# Altium schematic sheet transmitter.SchDoc
size A3
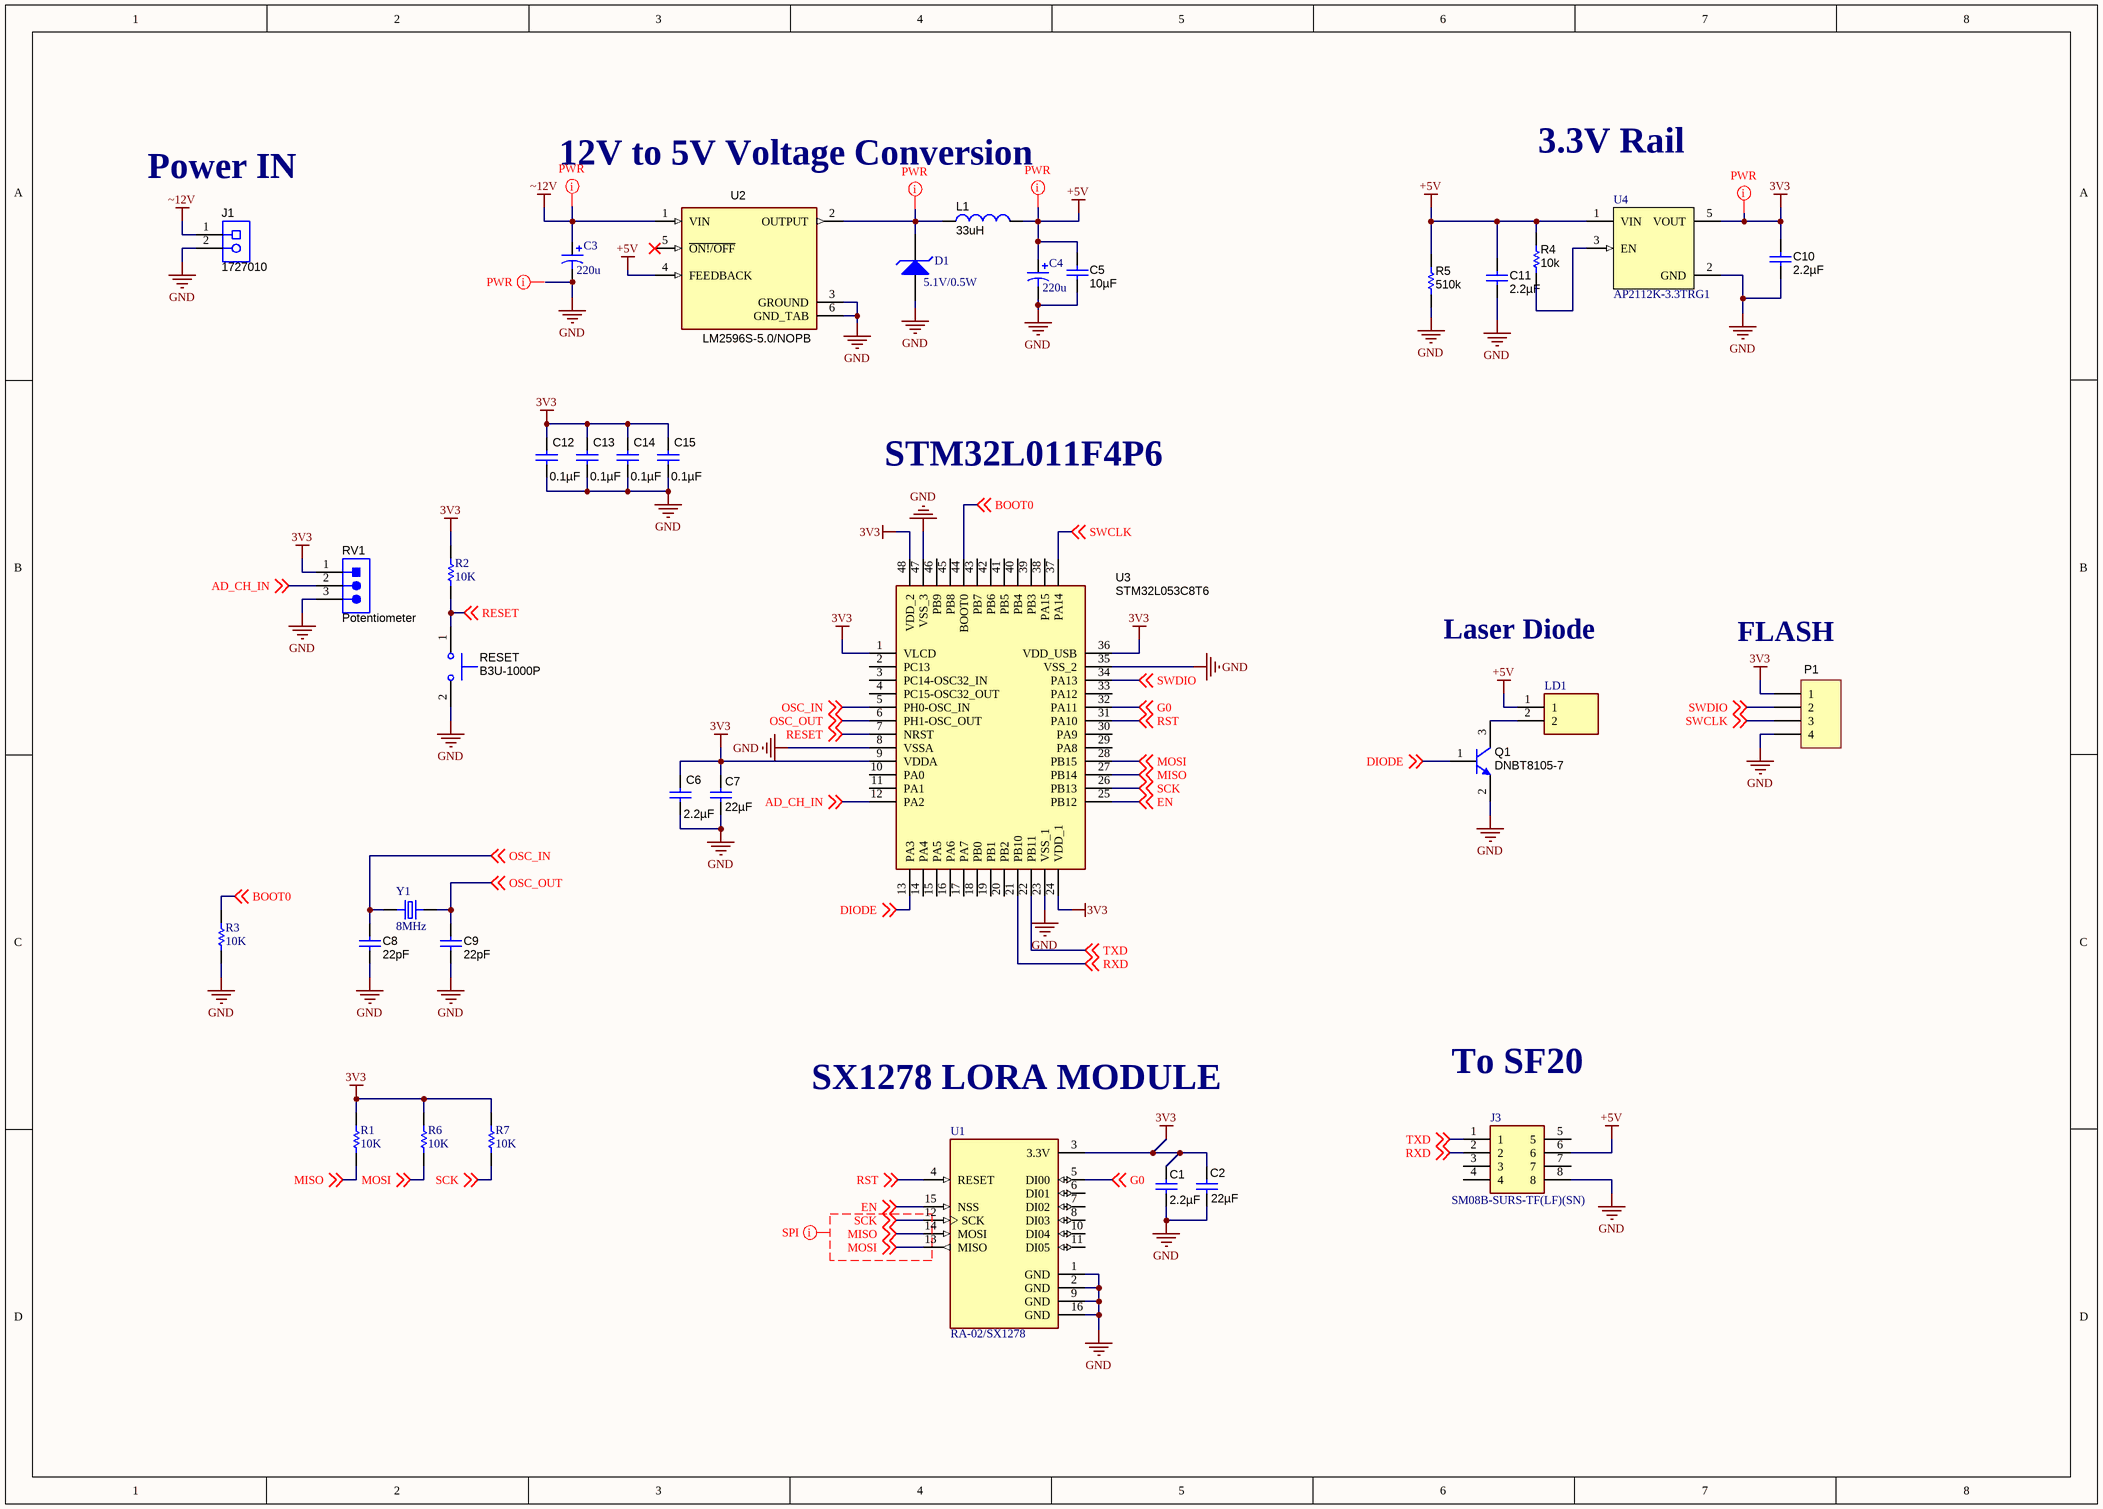
[diagram p0: transmitter.SchDoc]

## Parts
C1  ValueDisplayed: 2.2µF  [0603]  (hidden comment: C1608X6S1C225K080AC)
C2  ValueDisplayed: 22µF  [1206_180]  (hidden comment: C3216X5R1V226M160AC)
C3  220u  [CAPPRD250W50D630H1120B]
C4  220u  [CAPPRD250W50D630H1120B]
C5  ValueDisplayed: 10µF  [0805_HV]  (hidden comment: EMK212BB7106MG-T)
C6  ValueDisplayed: 2.2µF  [0603]  (hidden comment: C1608X6S1C225K080AC)
C7  ValueDisplayed: 22µF  [1206_180]  (hidden comment: C3216X5R1V226M160AC)
C8  ValueDisplayed: 22pF  [0805_HV]  (hidden comment: 0805YD225KAT2A)
C9  ValueDisplayed: 22pF  [0805_HV]  (hidden comment: 0805YD225KAT2A)
C10  ValueDisplayed: 2.2µF  [0805_HV]  (hidden comment: 0805YD225KAT2A)
C11  ValueDisplayed: 2.2µF  [0805_HV]  (hidden comment: 0805YD225KAT2A)
C12  ValueDisplayed: 0.1µF  [0603]  (hidden comment: C1608X6S1C225K080AC)
C13  ValueDisplayed: 0.1µF  [0603]  (hidden comment: C1608X6S1C225K080AC)
C14  ValueDisplayed: 0.1µF  [0603]  (hidden comment: C1608X6S1C225K080AC)
C15  ValueDisplayed: 0.1µF  [0603]  (hidden comment: C1608X6S1C225K080AC)
D1  5.1V/0.5W  [SOD-123]
J1  1727010  [PhoenixConact_1727010]
J3  SM08B-SURS-TF(LF)(SN)  [SM08B-SURS-TF]
L1  33uH  [IND_MSS1210-153MEB]
LD1  Header-2pin(2.5mm)  [B2B-XH-A(LF)(SN)]  (value not drawn)
P1  0901471104  [HDR1X4]  (value not drawn)
Q1  DNBT8105-7  [SOT-23]
R1  10K  [R0805]
R2  10K  [R0805]
R3  10K  [R0805]
R4  ValueDisplayed: 10k  [0603]  (hidden comment: CRCW060310K0JNEA)
R5  ValueDisplayed: 510k  [0805_HV]  (hidden comment: CRCW0805510KJNEA)
R6  10K  [R0805]
R7  10K  [R0805]
RESET  B3U-1000P  [SW_B3U-1000P]
RV1  Potentiometer  [WURTH_61300311121]
U1  RA-02/SX1278  [MODULE_RA-02_LORA]
U2  LM2596S-5.0/NOPB  [TO170P1524X483-6N]
U3  STM32L053C8T6  [QFP50P900X900X160-48N]
U4  AP2112K-3.3TRG1  [SOT95P285X140-5N]
Y1  8MHz  [XTAL_ECS-160-20-4XDN]

## Nets
3V3: C1.1 C2.1 C6.1 C7.1 C10.1 C12.1 C13.1 C14.1 C15.1 P1.1 R1.2 R2.2 R6.2 R7.2 RV1.1 U1.3(3.3V) U3.1(VLCD) U3.9(VDDA) U3.24(VDD_1) U3.36(VDD_USB) U3.48(VDD_2) U4.5(VOUT)
+5V: C4.1 C5.1 C11.1 J3.6 L1.2 LD1.1 R4.2 R5.2 U2.4(FEEDBACK) U4.1(VIN)
GND: C1.2 C2.2 C3.2 C4.2 C5.2 C6.2 C7.2 C8.2 C9.2 C10.2 C11.2 C12.2 C13.2 C14.2 C15.2 D1.1(A) J1.2 J3.8 P1.4 Q1.2(E) R3.1 R5.1 RESET.2 RV1.3 U1.1(GND) U1.2(GND) U1.9(GND) U1.16(GND) U2.3(GROUND) U2.6(GND_TAB) U3.8(VSSA) U3.23(VSS_1) U3.35(VSS_2) U3.47(VSS_3) U4.2(GND)
~12V: C3.1 J1.1 U2.1(VIN)
AD_CH_IN: RV1.2 U3.12(PA2) ; off-sheet AD_CH_IN
BOOT0: R3.2 U3.44(BOOT0) ; off-sheet BOOT0
DIODE: Q1.1(B) U3.13(PA3) ; off-sheet DIODE
EN: U1.15(NSS) U3.25(PB12) ; off-sheet EN
G0: U1.5(DI00) U3.32(PA11) ; off-sheet G0
MISO: R1.1 U1.14(MOSI) U3.27(PB14) ; off-sheet MISO
MOSI: R6.1 U1.13(MISO) U3.28(PB15) ; off-sheet MOSI
OSC_IN: C8.1 U3.5(PH0-OSC_IN) Y1.1 ; off-sheet OSC_IN
OSC_OUT: C9.1 U3.6(PH1-OSC_OUT) Y1.2 ; off-sheet OSC_OUT
RESET: R2.1 RESET.1 U3.7(NRST) ; off-sheet RESET
RST: U1.4(RESET) U3.31(PA10) ; off-sheet RST
RXD: J3.2 U3.21(PB10) ; off-sheet RXD
SCK: R7.1 U1.12(SCK) U3.26(PB13) ; off-sheet SCK
SWCLK: P1.3 U3.37(PA14) ; off-sheet SWCLK
SWDIO: P1.2 U3.34(PA13) ; off-sheet SWDIO
TXD: J3.1 U3.22(PB11) ; off-sheet TXD
NetD1_2: D1.2(K) L1.1 U2.2(OUTPUT)
NetLD1_2: LD1.2 Q1.3(C)
NetR4_1: R4.1 U4.3(EN)

Not connected (* = marked no-connect by the designer): J3 3 4 5 7; U1 6(DI01) 7(DI02) 8(DI03) 10(DI04) 11(DI05); U2 5(~{ON!/OFF})*; U3 2(PC13) 3(PC14-OSC32_IN) 4(PC15-OSC32_OUT) 10(PA0) 11(PA1) 14(PA4) 15(PA5) 16(PA6) 17(PA7) 18(PB0) 19(PB1) 20(PB2) 29(PA8) 30(PA9) 33(PA12) 38(PA15) 39(PB3) 40(PB4) 41(PB5) 42(PB6) 43(PB7) 45(PB8) 46(PB9)

## Layout directives
net class PWR: 3V3, (no net found under the mark), +5V, NetD1_2, ~12V
net class SPI: MISO, MOSI, SCK

## Notes on the sheet
- (near J1) Power IN
- 12V to 5V Voltage Conversion
- 3.3V Rail
- STM32L011F4P6
- Laser Diode
- (near P1) FLASH
- SX1278 LORA MODULE
- To SF20

## Library data of the parts
C1 C6 C12-C15 = C1608X6S1C225K080AC: CAP, CERM, 2.2 µF, 16 V, +/- 10%, X6S, 0603; Manufacturer: TDK; Polarized: N; CompType: Capacitor; Value: 2.2uF; U/M: EA; Cap_F: 0.0000022; Tolerance_%: 10; ESR_ohm: 0.007674; Value1: 0.007674 ohm; VDC_V: 16; Value2: 16V; IRMS_A: 1.87823; TaMin_C: -55; TaMax_C: 105; SizeArea_mm2: 1.28; SizeAreaWB_mm2: 4.68; SizeX_mm: 1.6; SizeY_mm: 0.8; SizeZ_mm: 1; AEC Category: Q200; SymbolVersion: 2008-07-09; PartNumber: C1608X6S1C225K080AC; PackageReference: 0603; RoHS: Y; MountType: SMT; Technology: Ceramic; TempCo: X6S; Cap_Case: 0603; Published: 2008-06-19; Publisher: Texas Instruments; LatestRevisionDate: 2017-04-28; ComponentLink1Description: Datasheet link; ComponentLink1URL: https://product.tdk.com/en/search/capacitor/ceramic/mlcc/info?part_no=C1608X6S1C225K080AC; Supplier 1: Digi-Key; Supplier Part Number 1: 445-7438-1-ND; Supplier 2: Mouser; Supplier Part Number 2: 810-C1608X6S1C225K080AC; AEC Qualified: N; AEC Grade: N/A
C2 C7 = C3216X5R1V226M160AC: CAP, CERM, 22 µF, 35 V,+/- 20%, X5R, 1206; Manufacturer: TDK; Polarized: N; CompType: Capacitor; Value: 22uF; U/M: EA; Cap_F: 0.000022; Tolerance_%: 20; ESR_ohm: 0.002398; Value1: 0.002398 ohm; VDC_V: 35; Value2: 35V; IRMS_A: 4.68507; TaMin_C: -55; TaMax_C: 85; Cap_Case: 1206; SizeArea_mm2: 5.12; SizeAreaWB_mm2: 10.92; SizeX_mm: 3.2; SizeY_mm: 1.6; SizeZ_mm: 1.8; AEC Category: Q200; Green_Lifecycle: Active; Green_REACh: Passed; SymbolVersion: 2008-07-09; PartNumber: C3216X5R1V226M160AC; PackageReference: 1206; RoHS: Y; MountType: SMT; Technology: Ceramic; TempCo: X5R; Published: 2008-06-19; Publisher: Texas Instruments; LatestRevisionDate: 2017-06-22; ComponentLink1Description: Datasheet link; ComponentLink1URL: https://product.tdk.com/en/search/capacitor/ceramic/mlcc/info?part_no=C3216X5R1V226M160AC; Supplier 1: Digi-Key; Supplier Part Number 1: 445-8045-1-ND; Supplier 2: Newark; Supplier Part Number 2: 04X3299; Supplier 3: Mouser; Supplier Part Number 3: 810-C3216X5R1V226M; AEC Qualified: N; AEC Grade: N/A; Green_EU RoHS: Passed; Green_EU RoHS-2: Passed
C3 C4 = UCS2C221MHD1TN: CAP ALUM 220UF 20% 160V RADIAL; Manufacturer: Nichicon; Ripple Current: 2.37A; Life (Hours): 10000Hour; Lead Diameter: 0.8mm; Supplier 1: Digi-Key; Manufacturer Part Number: UCS2C221MHD1TN; Stock 1: 84250; Pricing 1: 250=0.7974, 500=0.6778, 750=0.6379, 1250=0.5981, 2500=0.5582, 6250=0.5383, 12500=0.5084, 25000=0.4984 (USD); Mount: Through Hole; Case/Package: Radial; Min Operating Temperature: -40°C; Max Operating Temperature: 105°C; Capacitance: 220uF; Tolerance: 20%; Package Quantity: 250; Packaging: Tape and Reel; Voltage Rating: 160V; Termination: Radial; Diameter: 16mm; Height: 25mm; Lead Pitch: 7.5mm; Height - Seated (Max): 1.063inch; Radiation Hardening: No; ComponentLink1URL: http://www.nichicon.co.jp/english/products/pdfs/e-cs.pdf?src-supplier=Avnet; ComponentLink1Description: http://www.nichicon.co.jp/english/products/pdfs/e-cs.pdf?src-supplier=Avnet; ComponentLink2URL: http://nichicon-us.com/english/products/pdfs/e-ucs.pdf?src-supplier=Digi-Key; ComponentLink2Description: http://nichicon-us.com/english/products/pdfs/e-ucs.pdf?src-supplier=Digi-Key; ComponentLink3URL: http://nichicon-us.com/english/products/pdfs/e-ch_ta.pdf?src-supplier=Digi-Key; ComponentLink3Description: http://nichicon-us.com/english/products/pdfs/e-ch_ta.pdf?src-supplier=Digi-Key; ComponentLink4URL: http://www.nichicon.co.jp/english/products/pdfs/e-cs.pdf?src-supplier=Avnet+Europe; ComponentLink4Description: http://www.nichicon.co.jp/english/products/pdfs/e-cs.pdf?src-supplier=Avnet+Europe; Supplier Part Number 1: 493-13277-3-ND
C5 = EMK212BB7106MG-T: CAP, CERM, 10 µF, 16 V, +/- 20%, X7R, 0805; Manufacturer: Taiyo Yuden; Polarized: N; CompType: Capacitor; Value: 10uF; U/M: EA; Cap_F: 0.00001; Tolerance_%: 20; Value1: Unknown; VDC_V: 16; Value2: 16V; TaMin_C: -55; TaMax_C: 125; Cap_Case: 0805; SizeArea_mm2: 2.5; SizeAreaWB_mm2: 6.75; SizeX_mm: 2; SizeY_mm: 1.25; SizeZ_mm: 1.45; AEC Category: Q200; SymbolVersion: 2008-07-09; PartNumber: EMK212BB7106MG-T; PackageReference: 0805; RoHS: Y; MountType: SMT; Technology: Ceramic; TempCo: X7R; Published: 2008-06-19; Publisher: Texas Instruments; LatestRevisionDate: 2017-01-20; ComponentLink1Description: Datasheet link; ComponentLink1URL: http://www.yuden.co.jp/productdata/catalog/en/mlcc_all_e.pdf; Supplier 1: Digi-Key; Supplier Part Number 1: 587-3319-1-ND; Supplier 2: Mouser; Supplier Part Number 2: 963-EMK212BB7106MG-T; AEC Qualified: ?
C8 C9 = 0805YD225KAT2A: CAP, CERM, 2.2 µF, 16 V, +/- 10%, X5R, 0805; Manufacturer: AVX; Polarized: N; CompType: Capacitor; Value: 22pF; U/M: EA; Cap_F: 0.0000022; Tolerance_%: 10; ESR_ohm: 0.009; Value1: 0.009 ohm; VDC_V: 16; Value2: 16V; TaMin_C: -55; TaMax_C: 85; Cap_Case: 0805; SymbolVersion: 2008-07-09; PartNumber: 0805YD225KAT2A; PackageReference: 0805; RoHS: Y; MountType: SMT; Technology: Ceramic; TempCo: X5R; Published: 2008-06-19; Publisher: Texas Instruments; LatestRevisionDate: 2014-12-30; ComponentLink1Description: Datasheet link; ComponentLink1URL: http://www.avx.com/docs/masterpubs/smccp.pdf; Supplier 1: Digi-Key; Supplier Part Number 1: 478-2580-1-ND; Supplier 2: Mouser; Supplier Part Number 2: 581-0805YD225K; Supplier 3: Farnell; Supplier Part Number 3: 1650715
C10 C11 = 0805YD225KAT2A: CAP, CERM, 2.2 µF, 16 V, +/- 10%, X5R, 0805; Manufacturer: AVX; Polarized: N; CompType: Capacitor; Value: 2.2uF; U/M: EA; Cap_F: 0.0000022; Tolerance_%: 10; ESR_ohm: 0.009; Value1: 0.009 ohm; VDC_V: 16; Value2: 16V; TaMin_C: -55; TaMax_C: 85; Cap_Case: 0805; SymbolVersion: 2008-07-09; PartNumber: 0805YD225KAT2A; PackageReference: 0805; RoHS: Y; MountType: SMT; Technology: Ceramic; TempCo: X5R; Published: 2008-06-19; Publisher: Texas Instruments; LatestRevisionDate: 2014-12-30; ComponentLink1Description: Datasheet link; ComponentLink1URL: http://www.avx.com/docs/masterpubs/smccp.pdf; Supplier 1: Digi-Key; Supplier Part Number 1: 478-2580-1-ND; Supplier 2: Mouser; Supplier Part Number 2: 581-0805YD225K; Supplier 3: Farnell; Supplier Part Number 3: 1650715
D1 = 5.1V/0.5W zener: Diode Zener Single 5.1V 5% 500mW 2-Pin SOD-123 T/R; Manufacturer: Diodes; Manufacturer Part Number: MMSZ5231B-7-F; Forward Voltage: 900mV; Impedance: 17R; Max Reverse Leakage Current: 5uA; Test Current: 20mA; ESD Protection: No; Supplier 1: Digi-Key; Stock 1: 856806; Pricing 1: 1=0.14, 10=0.126, 100=0.0596, 500=0.0354, 1000=0.0232 (USD); Mount: Surface Mount; Case/Package: SOD-123-2; Number of Pins: 2; Weight: 0.000353oz; Contact Plating: Tin,Matte; Min Operating Temperature: -65°C; Max Operating Temperature: 150°C; Packaging: Tape and Reel; Max Power Dissipation: 500mW; Package Quantity: 3000; Tolerance: 5%; Zener Voltage: 5.1V; Voltage Tolerance: 5%; Power Dissipation: 500mW; Zener Current: 5uA; Working Voltage: 5.1V; Max Reverse Current: 5uA; Element Configuration: Single; Termination: SMD/SMT; Power Rating: 500mW; Voltage Rating (DC): 5.1V; Length: 3.85mm; Height: 1.35mm; Width: 1.7mm; Radiation Hardening: No; REACH SVHC: No SVHC; Lead Free: Lead Free; ComponentLink1URL: http://www.jameco.com/Jameco/Products/ProdDS/1541116.pdf?src-supplier=Jameco; ComponentLink1Description: http://www.jameco.com/Jameco/Products/ProdDS/1541116.pdf?src-supplier=Jameco; ComponentLink2URL: http://www.mouser.com/ds/2/115/ds18010-38133.pdf?src-supplier=Mouser; ComponentLink2Description: http://www.mouser.com/ds/2/115/ds18010-38133.pdf?src-supplier=Mouser; ComponentLink3URL: https://www.verical.com/server-webapp/html/getDatasheet?partID=141394&src-supplier=Verical; ComponentLink3Description: https://www.verical.com/server-webapp/html/getDatasheet?partID=141394&src-supplier=Verical; Supplier Part Number 1: MMSZ5231B-FDIDKR-ND
J1 = 1727010: Conn Term Block, 2POS, 3.81mm, TH; Manufacturer: Phoenix Contact; SymbolCreator: a0412235; CompType: Terminal Block; SymbolVersion: 2013-09-04; PartNumber: 1727010; PackageReference: 2POS Terminal Block; RoHS: Y; MountType: TH; ComponentLink1Description: Datasheet URL; ComponentLink1URL: http://eshop.phoenixcontact.com/phoenix/pdf.do?UID=1727010&general=usen; Publisher: Texas Instruments; LatestRevisionDate: 2016-07-13; Supplier 1: Digi-Key; Supplier Part Number 1: 277-1947-ND
J3 = SM08B-SURS-TF(LF)(SN): CONN HEADER SMD R/A 8POS 0.8MM; Manufacturer: JST; Body Plating: Tin; Number of Poles: 8; Current Rating: 500mA; Connector Type: Outer Shroud Contact; Working Voltage: 30V; Gender: Male; Voltage Rating: 50V; Insulation Resistance: 100MR; Wire/Cable Gauge: 32AWG; Pitch: 0.031inch; Supplier 1: Digi-Key; Manufacturer Part Number: SM08B-SURS-TF(LF)(SN); Stock 1: 2871; Pricing 1: 1=1.09, 10=0.958, 100=0.8263, 500=0.6761, 1000=0.6009 (USD); Mount: Surface Mount; Color: Natural; Contact Plating: Tin; Contact Material: Copper Alloy,Bronze,Brass; Material: Polyamide; Insulation Material: Nylon; Min Operating Temperature: -25°C; Max Operating Temperature: 85°C; Number of Rows: 1; Packaging: Tape and Reel; Number of Positions: 8; Termination: IDC; Number of Contacts: 8; Series: SUR; Contact Type: Outer Shroud Contact; Lead Pitch: 0.8mm; REACH SVHC: No SVHC; Lead Free: Lead Free; Flammability Rating: UL94 V-0; ComponentLink1URL: http://www.jst-mfg.com/product/pdf/eng/eSUR.pdf?src-supplier=Digi-Key; ComponentLink1Description: http://www.jst-mfg.com/product/pdf/eng/eSUR.pdf?src-supplier=Digi-Key; ComponentLink2URL: http://www.jst-mfg.com/product/pdf/eng/eSUR.pdf?src-supplier=Future+Electronics; ComponentLink2Description: http://www.jst-mfg.com/product/pdf/eng/eSUR.pdf?src-supplier=Future+Electronics; Supplier Part Number 1: 455-2040-6-ND
L1 = MSS1210-333MEB: Inductor COILCRAFT         MSS1210-333MEB             Surface Mount Power Inductor, MSS1210 Series, 1 mH, 1 A, 980 mA, Shielded, 1.03 ohm; Manufacturer Part Number: MSS1210-105KED; Core Material: Ferrite; Inductance Tolerance: 10%; Self Resonant Frequency: 1.1MHz; Inductance: 1mH; Max DC Current: 1A; DC Resistance (DCR): 1.03R; Test Frequency: 100kHz; Saturation Current: 980mA; Supplier 1: Mouser; Manufacturer: Coilcraft; Stock 1: 518; Pricing 1: 1=2.26, 10=2.02, 50=1.82, 100=1.62, 1000=1.17, 10000=1.09 (USD); Mount: Surface Mount; Case/Package: SMD/SMT; Min Operating Temperature: -40°C; Max Operating Temperature: 85°C; Packaging: Tape and Reel; Package Quantity: 300; Tolerance: 10%; Shielding: Shielded; Termination: SMD/SMT; RMS Current (Irms): 1A; Series: MSS1210; Length: 12.3mm; Width: 12.3mm; Height: 10.2mm; REACH SVHC: No SVHC; Lead Free: Contains Lead; ComponentLink1URL: http://www.farnell.com/datasheets/1681953.pdf?src-supplier=Element14; ComponentLink1Description: http://www.farnell.com/datasheets/1681953.pdf?src-supplier=Element14; ComponentLink2URL: http://www.mouser.com/ds/2/597/mss1210-270677.pdf?src-supplier=Mouser; ComponentLink2Description: http://www.mouser.com/ds/2/597/mss1210-270677.pdf?src-supplier=Mouser; Supplier Part Number 1: 994-MSS1210-105KED
LD1 = B2B-XH-A(LF)(SN): Conn Shrouded Header (4 Sides) HDR 2 POS 2.5mm Solder ST Thru-Hole Box; Manufacturer: JST; Color: Natural; Number of Positions: 2; Connector Type: Male Pin; Current Rating: 3A; Contact Resistance: 20mR; Voltage Rating: 250V; Insulation Resistance: 1GR; Wire/Cable Gauge: 22AWG; Supplier 1: Digi-Key; Manufacturer Part Number: B2B-XH-A(LF)(SN); Stock 1: 124367; Pricing 1: 1=0.15, 10=0.141, 25=0.1048, 50=0.0898, 250=0.0748, 750=0.0673, 1000=0.0628, 12000=0.0479, 24000=0.0434 (USD); Mount: Through Hole; Contact Plating: Tin,Copper,Lead; Contact Material: Brass; Housing Color: White; Housing Material: Polyamide; Min Operating Temperature: -25°C; Max Operating Temperature: 85°C; Number of Rows: 1; Packaging: Bulk; Termination: Solder; Series: XH; Contact Type: Male Pin; Fastening Type: Detent; Max Current Rating: 3A; Voltage Rating (AC): 250V; Max Voltage Rating (AC): 250V; Number of Contacts: 2; Max Voltage Rating (DC): 250V; Orientation: Straight; Length: 7.4mm; Pitch: 2.5mm; Lead Pitch: 2.5mm; Depth: 5.75mm; REACH SVHC: No SVHC; Lead Free: Lead Free; ComponentLink1URL: http://www.farnell.com/datasheets/2057209.pdf?src-supplier=Element14; ComponentLink1Description: http://www.farnell.com/datasheets/2057209.pdf?src-supplier=Element14; ComponentLink2URL: http://www.rapidonline.com/pdf/523653.pdf?src-supplier=Rapid+Electronics; ComponentLink2Description: http://www.rapidonline.com/pdf/523653.pdf?src-supplier=Rapid+Electronics; ComponentLink3URL: https://www.verical.com/server-webapp/html/getDatasheet?partID=640357&src-supplier=Verical; ComponentLink3Description: https://www.verical.com/server-webapp/html/getDatasheet?partID=640357&src-supplier=Verical; ComponentLink4URL: https://www.verical.com/server-webapp/html/getDatasheet?partID=385291&src-supplier=Verical; ComponentLink4Description: https://www.verical.com/server-webapp/html/getDatasheet?partID=385291&src-supplier=Verical; Supplier Part Number 1: 455-2247-ND
P1 = 0901471104: Conn Socket Strip F 4 POS 2.54mm Solder ST Thru-Hole C-Grid® Tube; Manufacturer: Molex; Number of Positions: 4; Connector Type: Receptacle; Pitch: 0.1inch; Supplier 1: Digi-Key; Manufacturer Part Number: 0901471104; Stock 1: 23124; Pricing 1: 1=1.51, 10=1.288, 100=1.064, 1000=0.84, 5000=0.7448, 10000=0.728 (USD); Mount: Through Hole; Contact Plating: Tin; Contact Material: Bronze; Housing Material: Polyester; Color: Black; Housing Color: Black; Min Operating Temperature: -55°C; Max Operating Temperature: 105°C; Number of Rows: 1; Packaging: Rail/Tube; Package Quantity: 4160; Termination: Solder; Number of Contacts: 4; Orientation: Straight; Series: C-Grid® 90147; Contact Type: Female Socket; Length: 10.16mm; Depth: 2.54mm; ComponentLink1URL: http://www.molex.com/pdm_docs/sd/901471102_sd.pdf?src-supplier=Digi-Key; ComponentLink1Description: http://www.molex.com/pdm_docs/sd/901471102_sd.pdf?src-supplier=Digi-Key; Supplier Part Number 1: WM14831-ND
Q1 = DNBT8105-7, Diodes Inc.: Transistor, NPN, 60 V, 1 A, AEC-Q101, SOT-23; CompType: BJT; PNP: 0; NPN: 1; Vceo_V: 60; Vcesat1_V: 0.25; Value: 60 V; Value1: 1 A; HfeMax: 300; TaMin_C: -55; TaMax_C: 150; SizeAreaWB_mm2: 14; SizeArea_mm2: 7.5; SizeX_mm: 2.5; SizeY_mm: 3; SizeZ_mm: 1.1; U/M: EA; AEC Category: Q101; AEC Qualified: Y; SymbolVersion: 2008-07-31; PartNumber: DNBT8105-7; Manufacturer: Diodes Inc.; PackageReference: SOT-23; RoHS: Y; IcRated_A: 1; Value2: 300; Published: 2008-07-31; LatestRevisionDate: 2017-04-05; Publisher: Texas Instruments; ComponentLink1Description: Datasheet link; ComponentLink1URL: https://www.diodes.com/assets/Datasheets/ds30513.pdf; Supplier 1: Digi-Key; Supplier Part Number 1: DNBT8105DICT-ND; Supplier 2: Newark; Supplier Part Number 2: 25R4543; Supplier 3: Mouser; Supplier Part Number 3: 621-DNBT8105-7; MountType: SMT
R1-R3 R6 R7 = RC0805FR-0722RL: RES SMD 22 OHM 1% 1/8W 0805; Manufacturer: Yageo; Resistance (Ohms): 22; Power (Watts): 0.125W, 1/8W; Temperature Coefficient: ±100ppm/°C; .Creator: MM; .Checked PCB: RF; Supplier 1: Digi-Key; Manufacturer Part Number: RC0805FR-0722RL; RoHS: RoHS Compliant; Category: Resistors; Stock 1: 63849; Pricing 1: 1=0.1, 10=0.021, 25=0.0148, 100=0.0084, 250=0.0064, 500=0.0051, 1000=0.00376, 2500=0.00326 (USD); Packaging: Cut Tape (CT); Tolerance: ±1%; Composition: Thick Film; Features: Moisture Resistant; Operating Temperature: -55°C ~ 155°C; Package / Case: 0805 (2012 Metric); Supplier Device Package: 0805; Size / Dimension: 0.079" L x 0.049" W (2.00mm x 1.25mm); Height: 0.024" (0.60mm); Number of Terminations: 2; ComponentLink1URL: http://www.yageo.com/documents/recent/PYu-RC_Group_51_RoHS_L_1.pdf; ComponentLink1Description: http://www.yageo.com/documents/recent/PYu-RC_Group_51_RoHS_L_1.pdf; Supplier Part Number 1: 311-22.0CRCT-ND; .Checked SCH: RF
R4 = CRCW060310K0JNEA: RES, 10 k, 5%, 0.1 W, 0603; Manufacturer: Vishay-Dale; CompType: Resistor; Value: 10k; Res_ohm: 10000; Value_Code: 10k0; Tolerance_%: 5; Power_W: 0.1; Value2: 0.1W; VDC_V: 75; TempCo: 200 ppm/C; SizeArea_mm2: 1.28; SizeX_mm: 1.6; SizeY_mm: 0.8; SizeZ_mm: 1; EIA_Code: E24; U/M: EA; AEC Category: Q200; SymbolVersion: 2009-05-29; PartNumber: CRCW060310K0JNEA; PackageReference: 0603; RoHS: Y; Value1: 5%; MountType: SMT; Technology: Thick Film; Published: 2008-06-26; Publisher: Texas Instruments; LatestRevisionDate: 2016-07-29; ComponentLink1Description: Datasheet link; ComponentLink1URL: http://www.vishay.com/docs/20035/dcrcwe3.pdf; Supplier 1: Digi-Key; Supplier Part Number 1: 541-10KGCT-ND; Supplier 2: Mouser; Supplier Part Number 2: 71-CRCW0603J-10K-E3; Supplier 3: Farnell; Supplier Part Number 3: 1469749; AEC Qualified: ?
R5 = CRCW0805510KJNEA: RES, 510 k, 5%, 0.125 W, 0805; Manufacturer: Vishay-Dale; CompType: Resistor; Value: 510k; Res_ohm: 510000; Tolerance_%: 5; Power_W: 0.125; Value2: 0.125W; VDC_V: 150; TempCo: 200 ppm/C; EIA_Code: E24; U/M: EA; AEC Category: Q200; SymbolVersion: 2009-05-29; PartNumber: CRCW0805510KJNEA; PackageReference: 0805; RoHS: Y; Value_Code: 510k; Value1: 5%; MountType: SMT; Technology: Thick Film; Published: 2008-06-26; Publisher: Texas Instruments; LatestRevisionDate: 2016-05-05; ComponentLink1Description: Datasheet link; ComponentLink1URL: http://www.vishay.com/docs/20035/dcrcwe3.pdf; Supplier 1: Digi-Key; Supplier Part Number 1: 541-510KACT-ND; Supplier 2: Mouser; Supplier Part Number 2: 71-CRCW0805J-510K-E3; Supplier 3: Farnell; Supplier Part Number 3: 1537987; AEC Qualified: ?
RESET = B3U-1000P: SWITCH TACTILE SPST-NO 0.05A 12V; Manufacturer: Omron Electronic Components; SymbolCreator: a0412235; VDC_V: 12; SwitchFunction: Off-Mom; PositionCount: 1; CurrentRating_mA: 50; SymbolVersion: 2012-10-29; PartNumber: B3U-1000P; MountType: SMT; ComponentLink1Description: Datasheet URL; ComponentLink1URL: http://www.components.omron.com/components/web/PDFLIB.nsf/0/2DD3893C7DD33E9E862572900079E9D6/$file/B3U_1110.pdf; RoHS: Y; Circuit: SPST-NO; Orientation: Top Actuated; CompType: Switch; PackageReference: 3x1.6x2.5mm; Publisher: Texas Instruments; LatestRevisionDate: 2015-08-27; Supplier 1: Digi-Key; Supplier Part Number 1: SW1020CT-ND; Supplier 2: Mouser; Supplier Part Number 2: 653-B3U-1000P; Supplier 3: Farnell; Supplier Part Number 3: 1333652
RV1 = 61300311121: Header, 2.54 mm, 3x1, Gold, TH; Manufacturer: Wurth Elektronik; SymbolCreator: a0799628; U/M: EA; SymbolVersion: 2013-03-28; PartNumber: 61300311121; PackageReference: Header, 2.54mm, 3x1, TH; ClassName: Header; CompType: Header; RoHS: Y; MountType: TH; ComponentLink1Description: Datasheet Link; ComponentLink1URL: http://katalog.we-online.de/em/datasheet/6130xx11121.pdf; Publisher: Texas Instruments; LatestRevisionDate: 2015-05-12; Supplier 1: Digi-Key; Supplier Part Number 1: 732-5316-ND
U1 = RA-02: LoRA module
U2 = LM2596S-5.0/NOPB: Conv DC-DC 4.5V to 40V Inv/Step Down Single-Out 5V 3A 6-Pin(5+Tab) TO-263 Tube; Manufacturer: TI National Semiconductor; Efficiency: 80%; Number of Outputs: 1; Switching Frequency: 173kHz; Quiescent Current: 5mA; Output Type: Fixed; Supplier 1: Mouser; Manufacturer Part Number: LM2596S-5.0/NOPB; Stock 1: 1433; Pricing 1: 1=5.73, 10=5.15, 50=4.86, 100=4, 1000=2.88, 10000=2.77 (USD); Mount: Surface Mount; Case/Package: TO-263; Number of Pins: 5; Weight: 0.25lb; Contact Plating: Tin,Matte; Min Operating Temperature: -40°C; Max Operating Temperature: 125°C; Package Quantity: 45; Series: LM2596; Min Input Voltage: 4.5V; Output Current: 3A; Output Voltage: 5V; Packaging: Rail/Tube; Max Output Current: 3A; Max Input Voltage: 40V; Nominal Output Voltage: 5V; Operating Supply Voltage: 40V; Length: 10.16mm; Width: 8.64mm; Height: 4.57mm; Radiation Hardening: No; Lead Free: Contains Lead; REACH SVHC: No SVHC; ComponentLink1URL: https://www.verical.com/server-webapp/html/getDatasheet?partID=112894&src-supplier=Verical; ComponentLink1Description: https://www.verical.com/server-webapp/html/getDatasheet?partID=112894&src-supplier=Verical; ComponentLink2URL: http://www.ti.com/lit/ds/symlink/lm2596.pdf?src-supplier=Digi-Key; ComponentLink2Description: http://www.ti.com/lit/ds/symlink/lm2596.pdf?src-supplier=Digi-Key; ComponentLink3URL: http://www.farnell.com/datasheets/1874590.pdf?src-supplier=Element14; ComponentLink3Description: http://www.farnell.com/datasheets/1874590.pdf?src-supplier=Element14; ComponentLink4URL: https://www.distrelec.biz/Web/Downloads/xx/_e/jqLM2596x-xx_e.pdf?mime=application%2Fpdf&src-supplier=Distrelec; ComponentLink4Description: https://www.distrelec.biz/Web/Downloads/xx/_e/jqLM2596x-xx_e.pdf?mime=application%2Fpdf&src-supplier=Distrelec; ComponentLink5URL: http://www.ti.com/lit/ds/symlink/lm2596.pdf?src-supplier=Avnet+Asia; ComponentLink5Description: http://www.ti.com/lit/ds/symlink/lm2596.pdf?src-supplier=Avnet+Asia; ComponentLink6URL: http://www.jameco.com/Jameco/Products/ProdDS/836385.pdf?src-supplier=Jameco; ComponentLink6Description: http://www.jameco.com/Jameco/Products/ProdDS/836385.pdf?src-supplier=Jameco; ComponentLink7URL: http://www.produktinfo.conrad.com/datenblaetter/1000000-1099999/001013813-da-01-en-IC_REG_BUC_LM2596S_5_0_NOPB_TO_263_5_TID.pdf?src-supplier=Conrad; ComponentLink7Description: http://www.produktinfo.conrad.com/datenblaetter/1000000-1099999/001013813-da-01-en-IC_REG_BUC_LM2596S_5_0_NOPB_TO_263_5_TID.pdf?src-supplier=Conrad; Supplier Part Number 1: 926-LM2596S-5.0/NOPB
U3 = STM32L053C8T6: IC MCU 32BIT 64KB FLASH 48LQFP; Manufacturer: STMicroelectronics; RAM Size: 8KB; Number of I/Os: 37; Frequency: 32MHz; Core Architecture: ARM; Max Power Dissipation: 363mW; Interface: I2C,SPI,USB,IrDA,UART,USART,I2S; Number of Timers/Counters: 5; Oscillator Type: Internal; Data Bus Width: 32b; Min Supply Voltage: 1.8V; Max Supply Voltage: 3.6V; Watchdog Timer: Yes; Peripherals: Brown-out Detect/Reset,POR,PWM,WDT,DMA,LCD; Number of ADC Channels: 10; Supplier 1: Digi-Key; Supplier Part Number 1: 497-14906-ND; Manufacturer Part Number: STM32L053C8T6; Stock 1: 7814; Pricing 1: 1=4.81, 10=4.317, 25=4.0808, 80=3.5366, 250=3.3553, 500=3.0107, 1000=2.645 (USD); Mount: Surface Mount; Case/Package: LQFP; Number of Pins: 48; Weight: 0.006409oz; Min Operating Temperature: -40°C; Max Operating Temperature: 85°C; Memory Size: 64KB; Packaging: Tray; Memory Type: FLASH; Package Quantity: 1500; Number of Programmable I/O: 37; Max Frequency: 32MHz; REACH SVHC: No SVHC; ComponentLink1URL: http://www.st.com/st-web-ui/static/active/en/resource/technical/document/datasheet/DM00105960.pdf?src-supplier=Avnet; ComponentLink1Description: http://www.st.com/st-web-ui/static/active/en/resource/technical/document/datasheet/DM00105960.pdf?src-supplier=Avnet
U4 = AP2112K-3.3TRG1: IC REG LINEAR 3.3V 600MA SOT25; Manufacturer: Diodes; Min Input Voltage: 2.5V; Number of Outputs: 1; Dropout Voltage: 250mV; Max Input Voltage: 6V; Quiescent Current: 55uA; Polarity: Positive; Accuracy: 1.5%; Output Type: Fixed; Supplier 1: Digi-Key; Manufacturer Part Number: AP2112K-3.3TRG1; Stock 1: 20198; Pricing 1: 1=0.47, 10=0.355, 25=0.32, 100=0.1745, 250=0.1687, 500=0.1513, 1000=0.1164 (USD); Mount: Surface Mount; Case/Package: SOT-23-5; Number of Pins: 5; Min Operating Temperature: -40°C; Max Operating Temperature: 85°C; Package Quantity: 1; Packaging: Tape and Reel; Output Voltage: 3.3V; Output Current: 600mA; Number of Regulators: 1; Max Output Current: 600mA; Length: 3.1mm; Height: 1.3mm; Width: 1.7mm; Lead Free: Lead Free; ComponentLink1URL: http://www.diodes.com/datasheets/AP2112.pdf?src-supplier=Avnet; ComponentLink1Description: http://www.diodes.com/datasheets/AP2112.pdf?src-supplier=Avnet; ComponentLink2URL: https://www.diodes.com/assets/Datasheets/AP2112.pdf?src-supplier=Digi-Key; ComponentLink2Description: https://www.diodes.com/assets/Datasheets/AP2112.pdf?src-supplier=Digi-Key; Supplier Part Number 1: AP2112K-3.3TRG1DIDKR-ND
Y1 = AS-16.000MAHK-B: Crystals 16.000MHz 30ppm 20pF -40C to 85C; Manufacturer: TXC; Frequency: 16MHz; ESR (Equivalent Series Resistance): 50R; Supplier 1: Digi-Key; Manufacturer Part Number: AS-16.000MAHK-B; Stock 1: 672; Pricing 1: 1=0.54, 10=0.45, 50=0.405, 100=0.36, 500=0.342, 1000=0.288, 2500=0.27, 5000=0.261, 10000=0.252 (USD); Mount: Through Hole; Number of Pins: 2; Min Operating Temperature: -40°C; Max Operating Temperature: 85°C; Package Quantity: 1000; Frequency Tolerance: 30ppm; Load Capacitance: 20pF; Packaging: Bulk; Tolerance: 30ppm; Frequency Stability: 30ppm; Termination: Radial; Length: 11.5mm; Width: 0.197inch; Height: 0.145inch; Depth: 5mm; Ratings: AEC-Q200; REACH SVHC: No SVHC; ComponentLink1URL: http://www.txccrystal.com/images/pdf/as-automotive.pdf?src-supplier=Digi-Key; ComponentLink1Description: http://www.txccrystal.com/images/pdf/as-automotive.pdf?src-supplier=Digi-Key; ComponentLink2URL: http://www.farnell.com/datasheets/1639152.pdf?src-supplier=Element14; ComponentLink2Description: http://www.farnell.com/datasheets/1639152.pdf?src-supplier=Element14; ComponentLink3URL: http://www.farnell.com/datasheets/1639152.pdf?src-supplier=Farnell; ComponentLink3Description: http://www.farnell.com/datasheets/1639152.pdf?src-supplier=Farnell; ComponentLink4URL: http://www.mouser.com/ds/2/417/as-automotive-10001.pdf?src-supplier=Mouser; ComponentLink4Description: http://www.mouser.com/ds/2/417/as-automotive-10001.pdf?src-supplier=Mouser; ComponentLink5URL: http://components.arrow.com/part/dataview/57418299S591311N4258?src-supplier=Arrow+Electronics; ComponentLink5Description: http://components.arrow.com/part/dataview/57418299S591311N4258?src-supplier=Arrow+Electronics; Supplier Part Number 1: 887-1591-ND